# Altium schematic sheet 04_Sensors_IO.SchDoc
size A; SheetNumber: 5; SheetTotal: 6
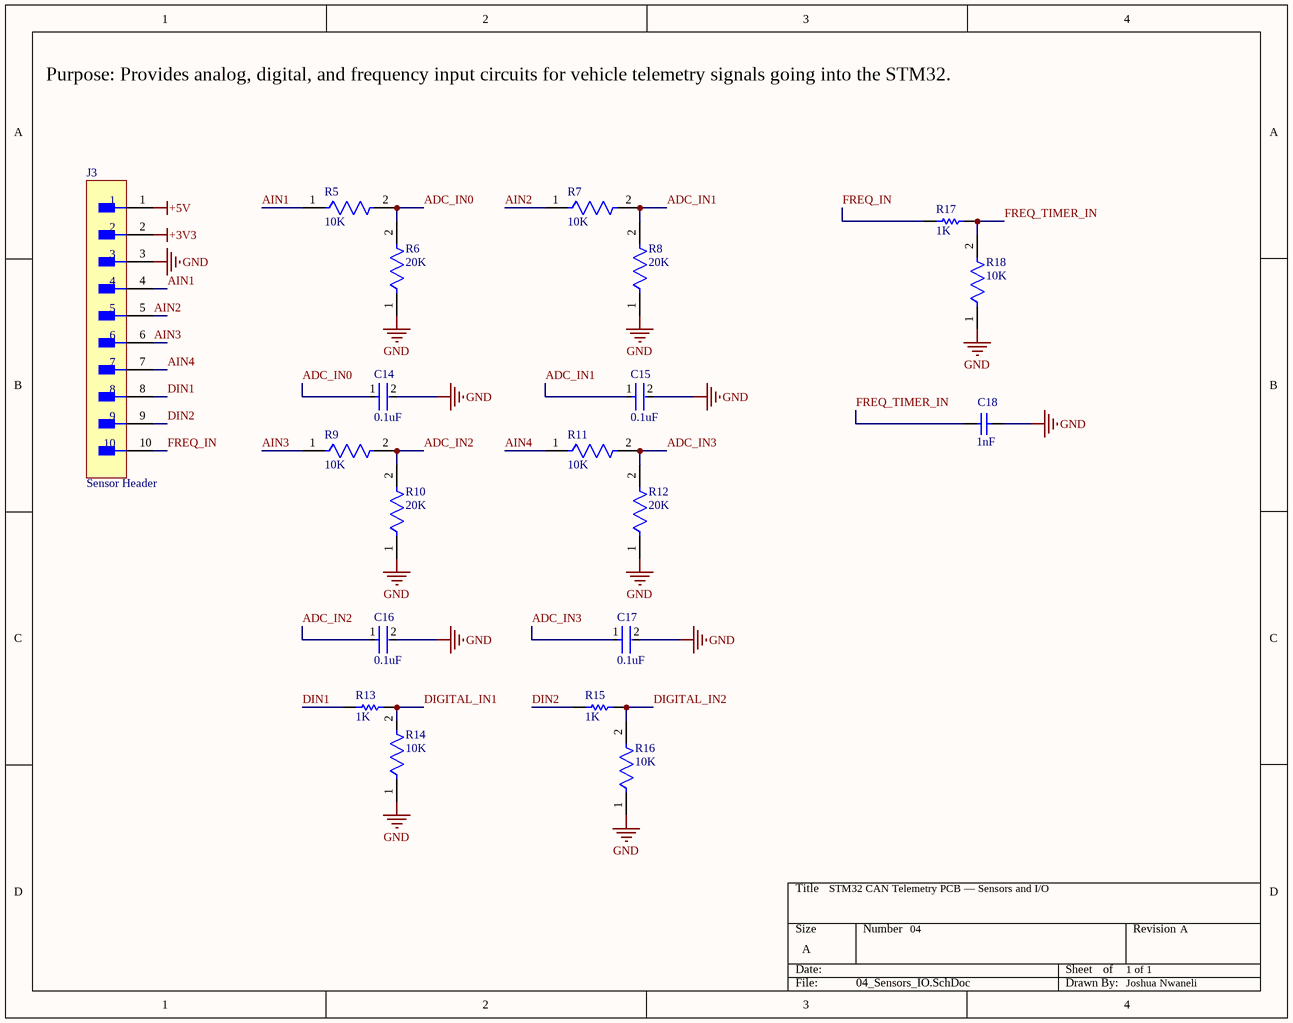
[diagram p0: 04_Sensors_IO.SchDoc]

## Parts
C14  0.1uF  [FP-CC0805-EB-MFG]
C15  0.1uF  [FP-CC0805-EB-MFG]
C16  0.1uF  [FP-CC0805-EB-MFG]
C17  0.1uF  [FP-CC0805-EB-MFG]
C18  1nF  [CAPC2013X127X50NL20T25]
J3  Sensor Header  [FP-TSW-110-07-T-S-MFG]
R5  10K  [FP-CRGP0805-IPC_C]
R6  20K  [FP-RN732A-MFG]
R7  10K  [FP-CRGP0805-IPC_C]
R8  20K  [FP-RN732A-MFG]
R9  10K  [FP-CRGP0805-IPC_C]
R10  20K  [FP-RN732A-MFG]
R11  10K  [FP-CRGP0805-IPC_C]
R12  20K  [FP-RN732A-MFG]
R13  1K  [RESC2013X50X30ML20T20]
R14  10K  [FP-CRGP0805-IPC_C]
R15  1K  [RESC2013X50X30ML20T20]
R16  10K  [FP-CRGP0805-IPC_C]
R17  1K  [RESC2013X50X30ML20T20]
R18  10K  [FP-CRGP0805-IPC_C]

## Nets
+3V3: J3.2
+5V: J3.1
GND: C14.2 C15.2 C16.2 C17.2 C18.2 J3.3 R6.1 R8.1 R10.1 R12.1 R14.1 R16.1 R18.1
ADC_IN0: C14.1 R5.2 R6.2
ADC_IN1: C15.1 R7.2 R8.2
ADC_IN2: C16.1 R9.2 R10.2
ADC_IN3: C17.1 R11.2 R12.2
AIN1: J3.4 R5.1
AIN2: J3.5 R7.1
AIN3: J3.6 R9.1
AIN4: J3.7 R11.1
DIGITAL_IN1: R13.2 R14.2
DIGITAL_IN2: R15.2 R16.2
DIN1: J3.8 R13.1
DIN2: J3.9 R15.1
FREQ_IN: J3.10 R17.1
FREQ_TIMER_IN: C18.1 R17.2 R18.2

## Notes on the sheet
- Purpose: Provides analog, digital, and frequency input circuits for vehicle telemetry signals going into the STM32.
- STM32 CAN Telemetry PCB — Sensors and I/O
- 04
- 1 of 1
- A
- Joshua Nwaneli

## Library data of the parts
C14-C17 = CMP-00621-107850848-1: CC0805KKX7RYBB104 Capacitor Ceramic 0.01uF 250V X7R 10% 0805 T/R; Capacitance: 100nF; Material: Ceramic; Max Operating Temperature: 125°C; Tolerance: 10%; Case/Package: 0805; NexarPartId: 107850848; Height: 1.45mm; Min Operating Temperature: -55°C; Voltage Rating: 250V
C18 = CMP-2007-04833-1: Part Number: 08052C102MAT2A; Manufacturer: AVX Interconnect / Elco
J3 = CMP-00575-00272505-1: TSW-110-07-T-S TSW - Samtec 2.54mm Pin Header 10.92mm Overall Pin Length (07) (mcv)(TO22); Manufacturer Lifecycle Status: PRODUCTION; Connector Type: Male Pin; Number of Positions: 10; Max Current Rating: 7.6A; Gender: Male; Max Voltage Rating (AC): 550V; Max Operating Temperature: 105°C; Packaging: Bulk; Lead Free: Lead Free; Min Operating Temperature: -55°C; Width: 2.54mm; RoHS: Compliant; Depth: 2.54mm; Lifecycle Status: Production; REACH SVHC: No SVHC; Height: 8.71mm; Number of Rows: 1; Housing Material: Polyester; Orientation: Straight; Radiation Hardening: No; Number of Contacts: 10; Housing Color: Black; Mount: Through Hole; Lead Pitch: 2.54mm; Termination: Solder; Color: Black; Contact Material: Nickel, Tin; Number of Pins: 10; Length: 25.4mm; Pitch: 2.54mm; Contact Plating: Tin; Contact Mating Length: 5.842mm
R5 R7 R9 R11 R14 R16 R18 = CMP-03211-006861-1: CRGP 0805 10K 1%; Manufacturer Part Number: CRGP0805F10K; Manufacturer: TE; Power Rating: 0.33W; Voltage Rating: 150V; Value: 10KΩ; Tolerance: 0.01; Temperature Coefficient: ±100ppm/°C; ComponentLink2URL: https://www.mouser.com/datasheet/2/418/NG_DS_9-1773463-9_A-1358566.pdf; Temperature Range Low: -55°C; Ipc Land Pattern Name: RESC200125X55; Device Class L2: Resistors; Automotive: No; Device Class L3: Chip SMD Resistors; Composition: Thick Film; Temperature Range High: +155°C; Temperature: -55°C to +155°C; Height: 0.65mm; Series: CRGP; RoHS: TRUE; Device Class L1: Passive Components; Octopart: https://octopart.com/crgp0805f10k-te+connectivity-91018782; Package: CRGP0805; Digikey Description: CRGP 0805 10K 1%; Ambient Temperature Range High: +70°C; Lead Free: Yes; ComponentLink2Description: Datasheet; Category: Res; Resistance: 10KΩ
R6 R8 R10 R12 = CMP-03211-001671-1: SMD Chip Resistor, Thin Film, 20KΩ, 100 V, 0805 [2012 Metric], 100 mW, 0.1%, RN73 Series; Manufacturer: TE Connectivity; Manufacturer Part Number: RN73C2A20KBTDF; Power Rating: 0.1W; Temperature Coefficient: 10ppm/°C; Voltage Rating: 100V; ComponentLink2URL: https://www.te.com/commerce/DocumentDelivery/DDEController?Action=showdoc&DocId=Data+Sheet%7F1773270%7FP%7Fpdf%7FEnglish%7FENG_DS_1773270_P.pdf%7F1676162-2; RoHS: TRUE; Category: Res; Temperature Range Low: -55°C; octopart_url: https://octopart.com/rn73c2a20kbtdf-te+connectivity-21411984; Resistance: 20KΩ; Value: 20KΩ; Temperature: -55°C to 155°C; Device Class L3: Chip SMD Resistors; Lead Free: Yes; Automotive: No; packaging: 1000 Reel; Device Class L2: Resistors; Octopart: https://octopart.com/rn73c2a20kbtdf-te+connectivity-21411984; Temperature Range High: 155°C; Device Class L1: Passive Components; Height: 0.65mm; ComponentLink2Description: Datasheet; Package: RN732A; Ipc Land Pattern Name: RESC200125X55; Composition: Thin Film; Series: RN73; Tolerance: 0.1%
R13 R15 R17 = CMP-2001-04268-1: Manufacturer: Vishay Dale; Part Number: CRCW08051K00FKTC